# EAGLE schematic Gimbal Controller Board (EAGLE 8.3.2)
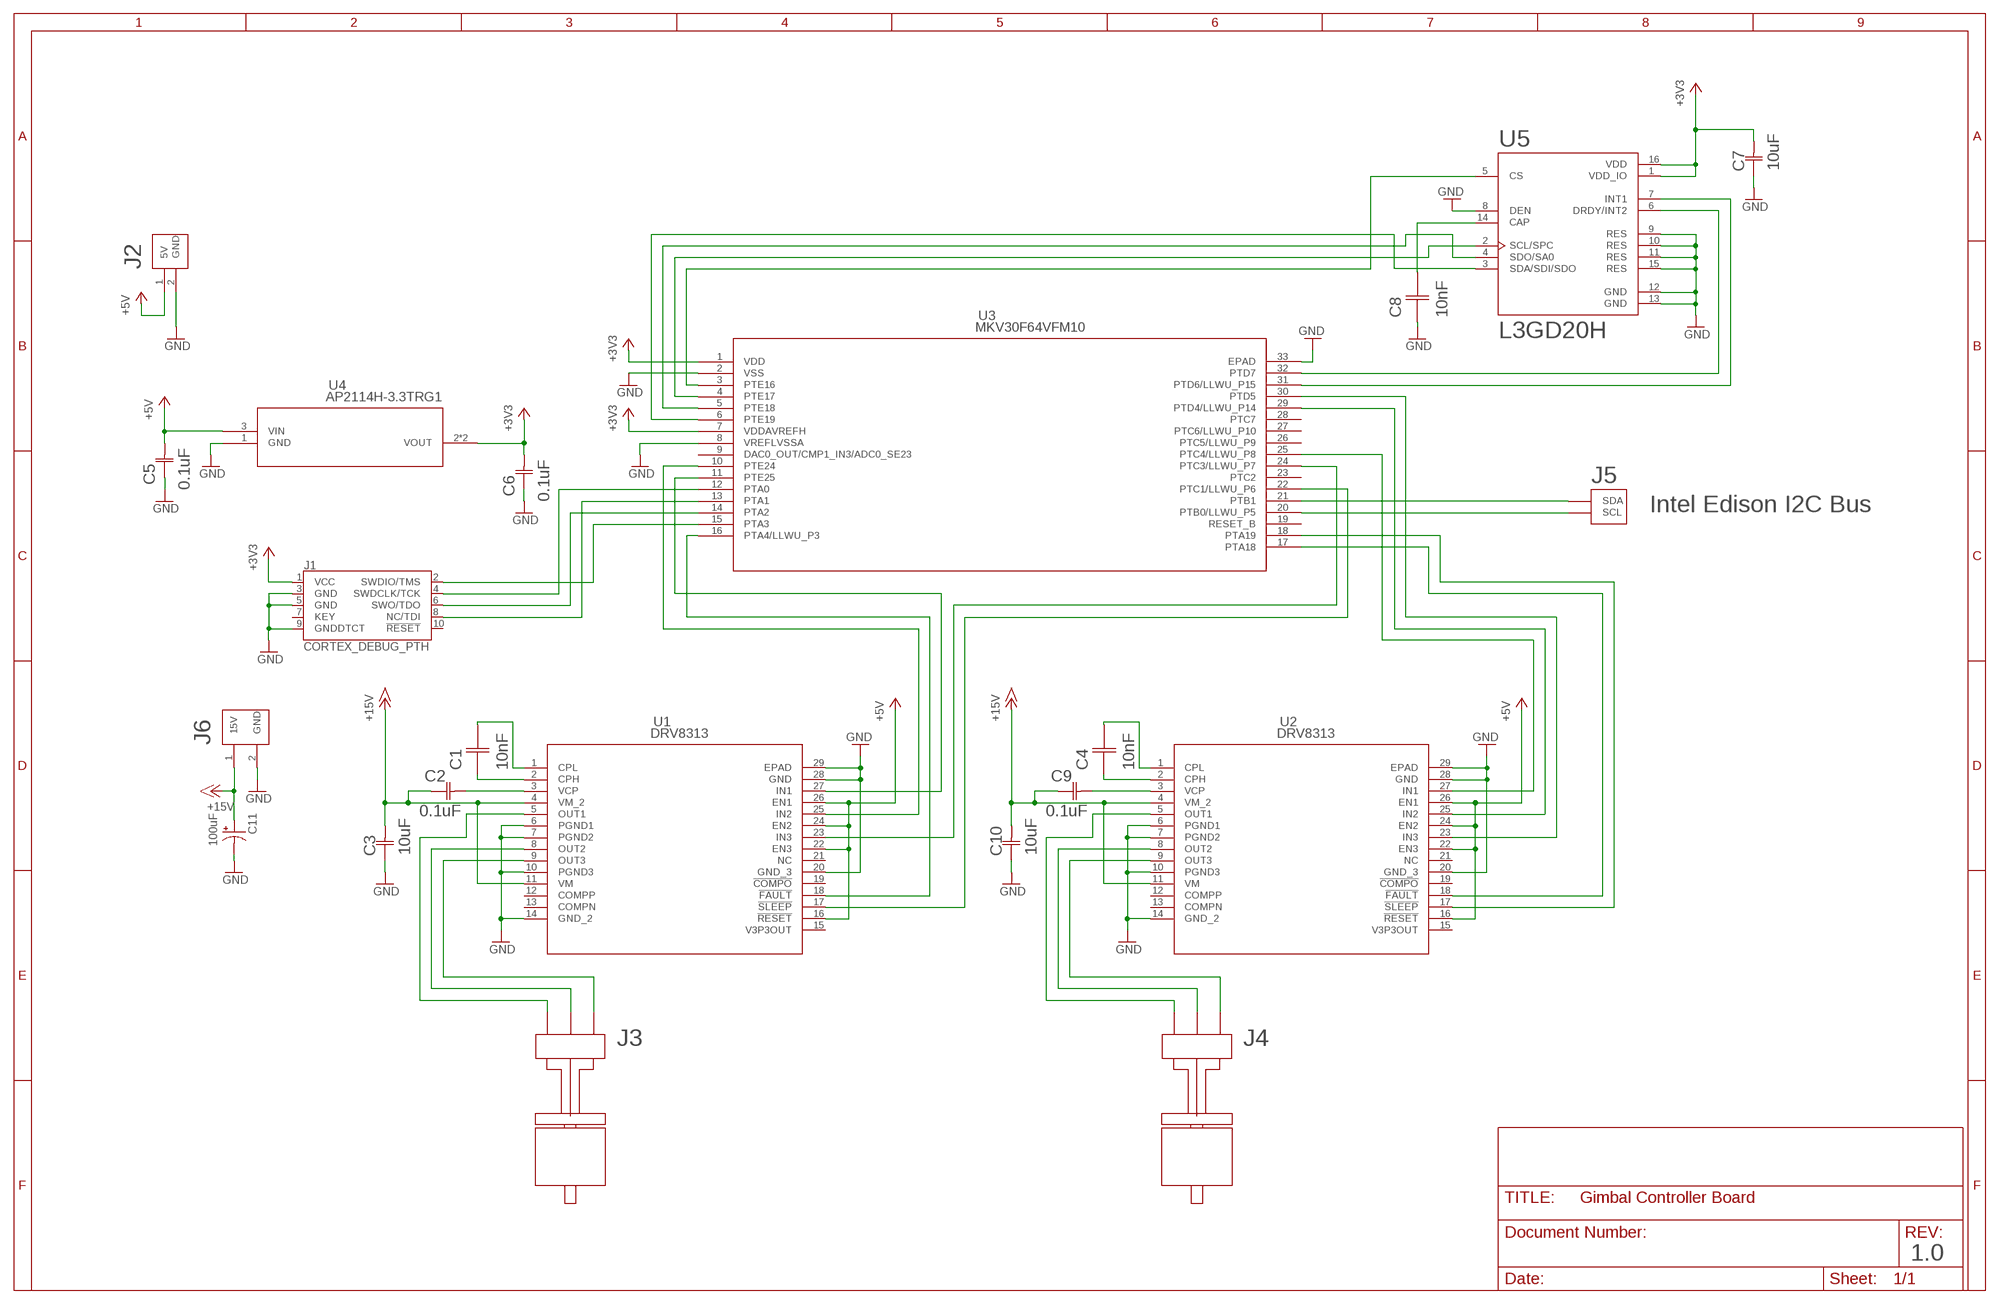
[diagram p0: schematic, sheet 1]

## Parts
C1  10nF  10NF_CAPACITOR  [0603_CAPACITOR]
C2  0.1uF  08055C104KAT2A  [0805]
C3  10uF  GRM21BR60J106ME19L  [G-21]
C4  10nF  10NF_CAPACITOR  [0603_CAPACITOR]
C5  0.1uF  08055C104KAT2A  [0805]
C6  0.1uF  08055C104KAT2A  [0805]
C7  10uF  GRM21BR60J106ME19L  [G-21]
C8  10nF  10NF_CAPACITOR  [0603_CAPACITOR]
C9  0.1uF  08055C104KAT2A  [0805]
C10  10uF  GRM21BR60J106ME19L  [G-21]
C11  100uF  100UF_CAPACITOR  [0810_POLCAP]
J1  CORTEX_DEBUG_PTH  [2X5-PTH-1.27MM]
J2  POWER_CONNECTOR  [XH_CONNECTOR]
J3  BLDC_MOTOR_CONNECTOR  [JST-XH_3POS]
J4  BLDC_MOTOR_CONNECTOR  [JST-XH_3POS]
J5  I2C_CONNECTOR  [XH_CONNECTOR]
J6  GIMBAL_POWER_CONNECTOR  [XH_CONNECTOR]
U1  DRV8313  DRV8313PWPRPWP28_5P18X3P1-M  [PWP28_5P18X3P1-M]
U2  DRV8313  DRV8313PWPRPWP28_5P18X3P1-M  [PWP28_5P18X3P1-M]
U3  MKV30F64VFM10  [QFN-32_5X5X0.9]
U4  AP2114H-3.3TRG1  [SOT-223]
U5  L3GD20H  [LGA16R50P7X5_300X300X100]

## Nets
+3V3: C6.2 C7.2 J1.1(VCC) U3.1(VDD) U3.7(VDDAVREFH) U4.2(VOUT) U4.4(VOUT) U5.1(VDD_IO) U5.16(VDD)
+5V: C5.2 J2.1(5V) U1.16(!RESET) U1.22(EN3) U1.24(EN2) U1.26(EN1) U2.16(!RESET) U2.22(EN3) U2.24(EN2) U2.26(EN1) U4.3(VIN)
+15V: C2.1 C3.2 C9.1 C10.2 C11.+ J6.1(15V) U1.4(VM_2) U1.11(VM) U2.4(VM_2) U2.11(VM)
GND: C3.1 C5.1 C6.1 C7.1 C8.1 C10.1 C11.- J1.3(GND) J1.5(GND) J1.9(GNDDTCT) J2.2(GND) J6.2(GND) U1.6(PGND1) U1.7(PGND2) U1.10(PGND3) U1.14(GND_2) U1.20(GND_3) U1.28(GND) U1.29(EPAD) U2.6(PGND1) U2.7(PGND2) U2.10(PGND3) U2.14(GND_2) U2.20(GND_3) U2.28(GND) U2.29(EPAD) U3.2(VSS) U3.8(VREFLVSSA) U3.33(EPAD) U4.1(GND) U5.8(DEN) U5.9(RES) U5.10(RES) U5.11(RES) U5.12(GND) U5.13(GND) U5.15(RES)
N$1: C1.1 U1.2(CPH)
N$2: C1.2 U1.1(CPL)
N$3: U1.25(IN2) U3.10(PTE24)
N$4: U1.17(!SLEEP) U3.22(PTC1/LLWU_P6)
N$5: J3.P$1 U1.5(OUT1)
N$6: U1.23(IN3) U3.24(PTC3/LLWU_P7)
N$7: U1.18(!FAULT) U3.16(PTA4/LLWU_P3)
N$8: U1.27(IN1) U3.11(PTE25)
N$9: J1.4(SWDCLK/TCK) U3.12(PTA0)
N$10: J1.6(SWO/TDO) U3.14(PTA2)
N$11: J1.8(NC/TDI) U3.13(PTA1)
N$12: J1.2(SWDIO/TMS) U3.15(PTA3)
N$13: J3.P$2 U1.8(OUT2)
N$14: J3.P$3 U1.9(OUT3)
N$15: J5.1(SCL) U3.20(PTB0/LLWU_P5)
N$16: J5.2(SDA) U3.21(PTB1)
N$17: U3.3(PTE16) U5.5(CS)
N$18: U3.4(PTE17) U5.2(SCL/SPC)
N$19: U3.5(PTE18) U5.4(SDO/SA0)
N$20: U3.6(PTE19) U5.3(SDA/SDI/SDO)
N$21: C8.2 U5.14(CAP)
N$22: C2.2 U1.3(VCP)
N$23: C4.1 U2.2(CPH)
N$24: C4.2 U2.1(CPL)
N$25: U3.32(PTD7) U5.6(DRDY/INT2)
N$26: U3.31(PTD6/LLWU_P15) U5.7(INT1)
N$27: U2.25(IN2) U3.29(PTD4/LLWU_P14)
N$28: U2.27(IN1) U3.25(PTC4/LLWU_P8)
N$29: U2.23(IN3) U3.30(PTD5)
N$30: U2.18(!FAULT) U3.17(PTA18)
N$31: U2.17(!SLEEP) U3.18(PTA19)
N$32: J4.P$1 U2.5(OUT1)
N$33: J4.P$2 U2.8(OUT2)
N$34: J4.P$3 U2.9(OUT3)
N$35: C9.2 U2.3(VCP)
Unconnected: J1.7(KEY) J1.10(!RESET) U1.12(COMPP) U1.13(COMPN) U1.15(V3P3OUT) U1.19(!COMPO) U1.21(NC) U2.12(COMPP) U2.13(COMPN) U2.15(V3P3OUT) U2.19(!COMPO) U2.21(NC) U3.9(DAC0_OUT/CMP1_IN3/ADC0_SE23) U3.19(RESET_B) U3.23(PTC2) U3.26(PTC5/LLWU_P9) U3.27(PTC6/LLWU_P10) U3.28(PTC7)

## Notes on the sheet
- Intel Edison I2C Bus
- 1.0

## Library data of the parts
C1 C4 C8 = thanics_robotics:10NF_CAPACITOR
C2 C5 C6 C9 = 0.1uF X7R Ceramic Capacitor:08055C104KAT2A; COPYRIGHT: Copyright C 2015 Accelerated Designs. All rights reserved; MANUFACTURER_PART_NUMBER: 08055C104KAT2A; VENDOR: Vendor
C3 C7 C10 = 10uF X5R Ceramic Capacitor:GRM21BR60J106ME19L; COPYRIGHT: Copyright C 2015 Accelerated Designs. All rights reserved; MANUFACTURER_PART_NUMBER: GRM21BR60J106ME19L; VENDOR: Vendor
C11 = thanics_robotics:100UF_CAPACITOR
J1 = SparkFun-Connectors:CORTEX_DEBUG: Cortex Debug Connector - 10 pin Supports JTAG debug, Serial Wire debug, and Serial Wire Viewer. PTH and SMD connector options available. General Connector Information <http://infocenter.arm.com/help/topic/com.arm.doc.faqs/attached/13634/cortex_debug_connectors.pdf> Products: PTH Connector <http://www.digikey.com/product-detail/en/cnc-tech/3220-10-0100-00/1175-1627-ND/3883661> -via Digi-Key SparkFun PSoc <https://www.sparkfun.com/products/13229> SparkFun T <https://www.sparkfun.com/products/13810>
J2 = thanics_robotics:POWER_CONNECTOR
J3 J4 = thanics_robotics:BLDC_MOTOR_CONNECTOR
J5 = thanics_robotics:I2C_CONNECTOR
J6 = thanics_robotics:GIMBAL_POWER_CONNECTOR
U1 U2 = DRV8313_BLDC_Driver:DRV8313PWPR; MANUFACTURER_PART_NUMBER: drv8313pwp; VENDOR: TEXAS INSTRUMENTS
U3 = ARM-cortex-m4-kinetis-vseries:MKV30F64VFM10; CPU: ARM Cortex-M4F; FLASHKB: 64; MANUFACTURER_PART_NUMBER: mkv30f64vfm10; MAXFREQUENCY: 100; PINCOUNT: 32; SRAMKB: 16; VENDOR: FREESCALE
U4 = 3.3V regulator:AP2114H-3.3TRG1; MANUFACTURER_PART_NUMBER: ap2114h3.3trg1; VENDOR: DIODESINC_2
U5 = L3GD20H:L3GD20H: MEMS motion sensor: three-axis digital output gyroscope; AVAILABILITY: Unavailable; DESCRIPTION: MEMS motion sensor: 3-axis digital output gyroscope; MF: STMicroelectronics; MP: L3GD20H; PACKAGE: LGA-16 STMicroelectronics; PRICE: 5.00 USD